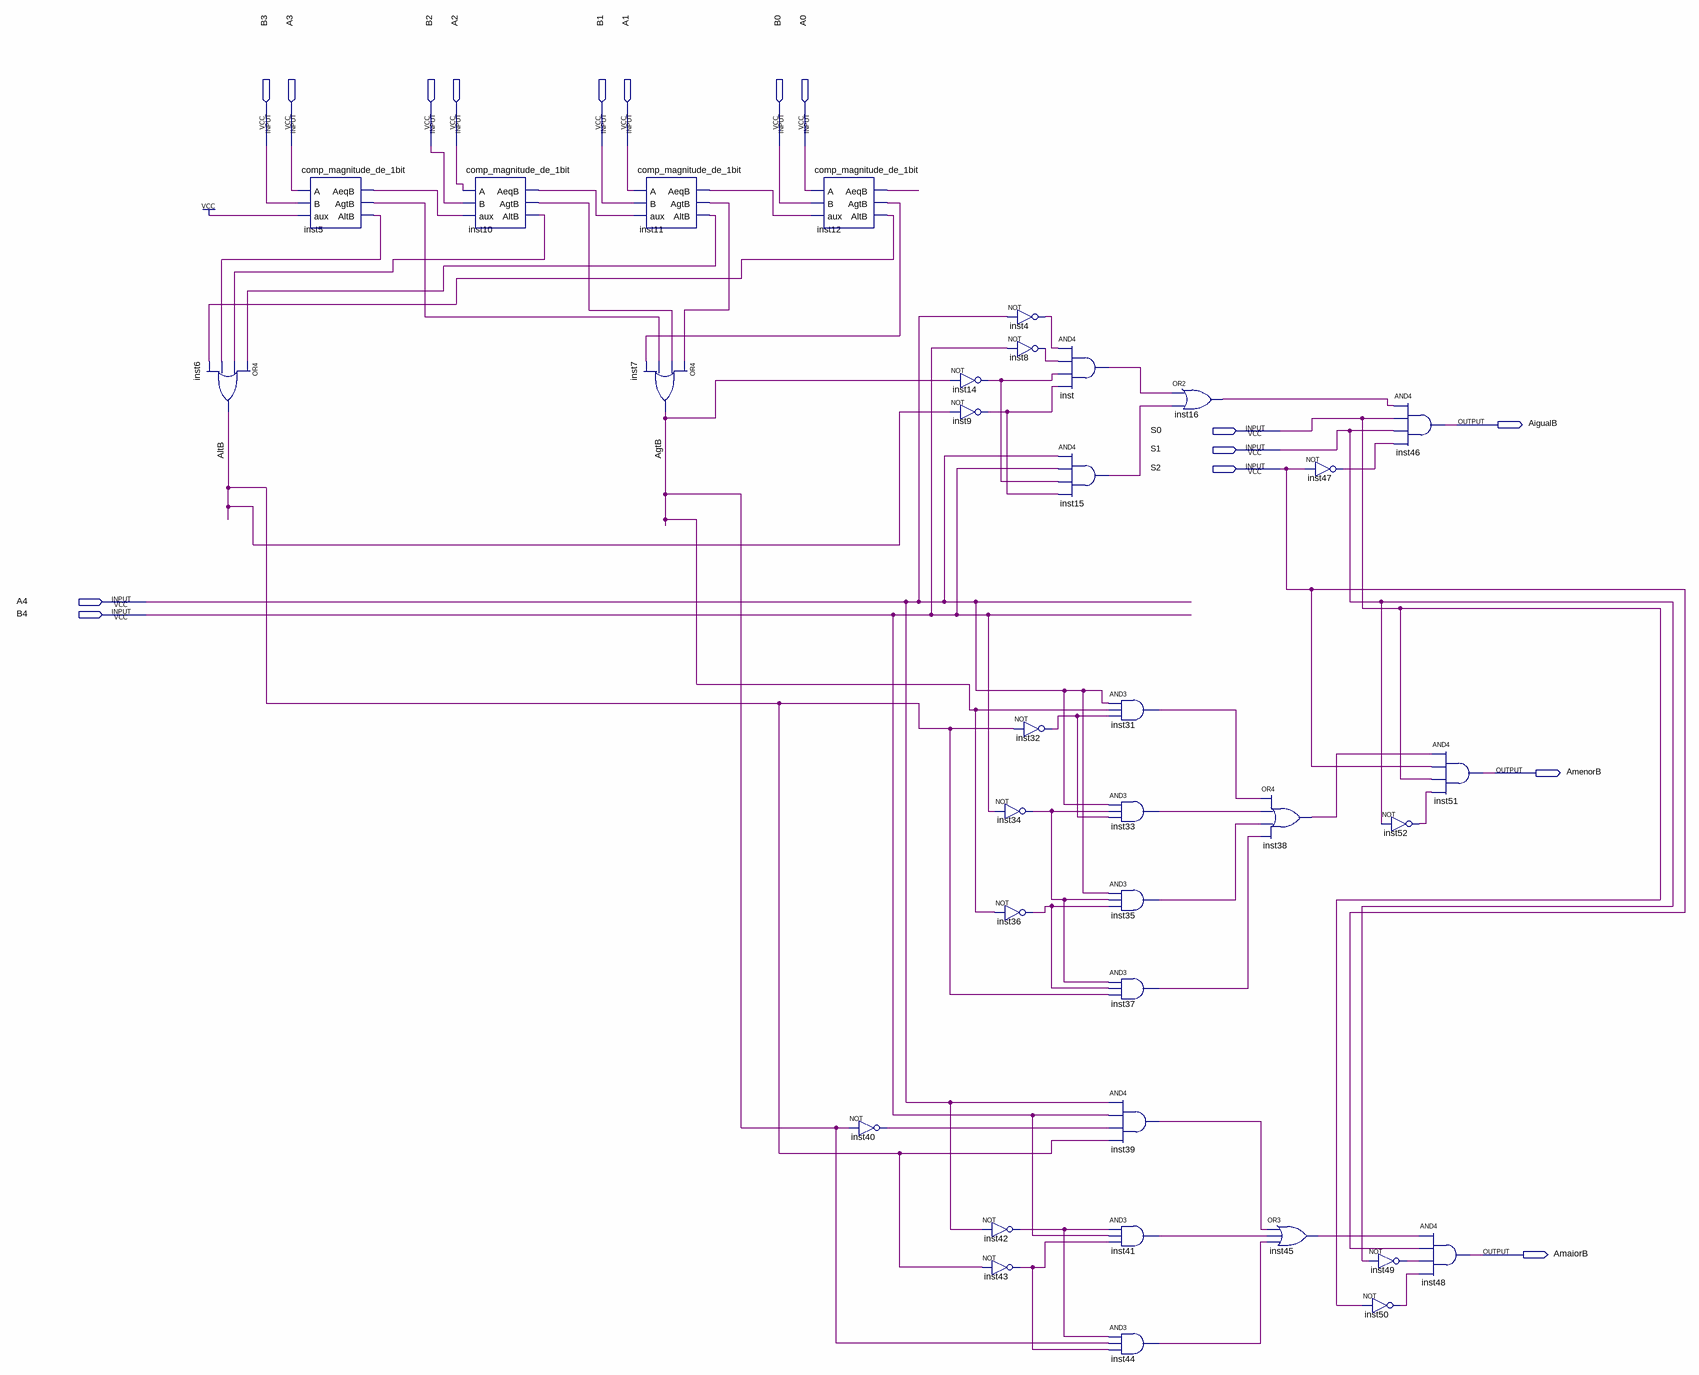
[diagram p0: schematic sheet]
// Quartus schematic comp_com_sinal.bdf as structural Verilog: 35 symbols, 16 pins
module comp_com_sinal (
  input  B3,
  input  A3,
  input  B2,
  input  A2,
  input  B1,
  input  A1,
  input  B0,
  input  A0,
  input  S0,
  input  S1,
  input  S2,
  input  A4,
  input  B4,
  output AigualB,
  output AmenorB,
  output AmaiorB
);

  wire AgtB, AltB, inst4_out, inst5_aeqb, inst5_agtb, inst5_altb, inst8_out, inst9_out, inst10_aeqb,
       inst10_agtb, inst10_altb, inst11_aeqb, inst11_agtb, inst11_altb, inst12_aeqb, inst12_agtb,
       inst12_altb, inst14_out, inst15_out, inst16_out, inst31_out, inst32_out, inst33_out, inst34_out,
       inst35_out, inst36_out, inst37_out, inst38_out, inst39_out, inst40_out, inst41_out, inst42_out,
       inst43_out, inst44_out, inst45_out, inst47_out, inst49_out, inst50_out, inst52_out, inst_out;

  or inst6 (AltB, inst11_altb, inst10_altb, inst5_altb, inst12_altb);
  comp_magnitude_de_1bit inst5 (.A(A3), .B(B3), .aux(1'b1), .AeqB(inst5_aeqb), .AgtB(inst5_agtb), .AltB(inst5_altb));
  comp_magnitude_de_1bit inst10 (
    .A(A2), .B(B2), .aux(inst5_aeqb), .AeqB(inst10_aeqb), .AgtB(inst10_agtb), .AltB(inst10_altb));
  comp_magnitude_de_1bit inst11 (
    .A(A1), .B(B1), .aux(inst10_aeqb), .AeqB(inst11_aeqb), .AgtB(inst11_agtb), .AltB(inst11_altb));
  or inst7 (AgtB, inst11_agtb, inst10_agtb, inst5_agtb, inst12_agtb);
  comp_magnitude_de_1bit inst12 (
    .A(A0), .B(B0), .aux(inst11_aeqb), .AeqB(inst12_aeqb), .AgtB(inst12_agtb), .AltB(inst12_altb));
  not inst40 (inst40_out, AgtB);
  not inst14 (inst14_out, AgtB);
  not inst9 (inst9_out, AltB);
  not inst4 (inst4_out, A4);
  not inst8 (inst8_out, B4);
  not inst32 (inst32_out, AltB);
  not inst34 (inst34_out, B4);
  not inst36 (inst36_out, AgtB);
  not inst42 (inst42_out, A4);
  not inst43 (inst43_out, AltB);
  and inst (inst_out, inst4_out, inst8_out, inst14_out, inst9_out);
  and inst15 (inst15_out, A4, B4, inst14_out, inst9_out);
  and inst31 (inst31_out, A4, AgtB, inst32_out);
  and inst33 (inst33_out, A4, inst34_out, inst32_out);
  and inst35 (inst35_out, A4, inst34_out, inst36_out);
  and inst37 (inst37_out, inst34_out, inst36_out, AltB);
  and inst39 (inst39_out, A4, B4, inst40_out, AltB);
  and inst41 (inst41_out, inst42_out, B4, inst43_out);
  and inst44 (inst44_out, inst42_out, AgtB, inst43_out);
  or inst16 (inst16_out, inst_out, inst15_out);
  or inst38 (inst38_out, inst31_out, inst33_out, inst35_out, inst37_out);
  or inst45 (inst45_out, inst39_out, inst41_out, inst44_out);
  not inst47 (inst47_out, S2);
  not inst49 (inst49_out, S1);
  not inst50 (inst50_out, S0);
  and inst46 (AigualB, inst16_out, S0, S1, inst47_out);
  not inst52 (inst52_out, S1);
  and inst48 (AmaiorB, inst45_out, S2, inst49_out, inst50_out);
  and inst51 (AmenorB, inst38_out, S2, S0, inst52_out);
endmodule
